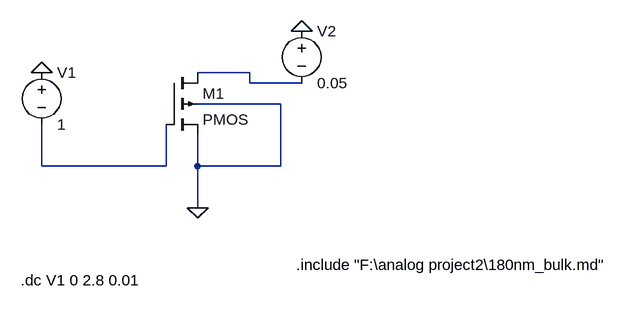
[diagram p0: schematic pmosCharateristics.asc]
pmosCharateristics.asc, the LTspice schematic file:
Version 4
SHEET 1 944 680
WIRE 288 128 208 128
WIRE 288 144 288 128
WIRE 368 144 288 144
WIRE 336 176 208 176
WIRE -32 272 -32 208
WIRE 160 272 160 208
WIRE 160 272 -32 272
WIRE 208 272 208 224
WIRE 336 272 336 176
WIRE 336 272 208 272
WIRE 208 336 208 272
FLAG -32 128 0
FLAG 368 64 0
FLAG 208 336 0
SYMBOL pmos4 160 128 R0
SYMATTR InstName M1
SYMATTR Value2 l=180n w=540n
SYMBOL voltage -32 112 R0
WINDOW 123 0 0 Left 2
WINDOW 39 0 0 Left 2
SYMATTR InstName V1
SYMATTR Value 1
SYMBOL voltage 368 48 R0
WINDOW 123 0 0 Left 2
WINDOW 39 0 0 Left 2
SYMATTR InstName V2
SYMATTR Value 0.05
TEXT 360 424 Left 2 !.include "F:\\analog project2\\180nm_bulk.md"
TEXT -64 448 Left 2 !.dc V1 0 2.8 0.01

The netlist it stands for:
* pmosCharateristics.asc
M1 N001 N002 0 0 PMOS l=180n w=540n
V1 0 N002 1
V2 0 N001 0.05
.model NMOS NMOS
.model PMOS PMOS
.lib standard.mos
.include "F:\analog project2\180nm_bulk.md"
.dc V1 0 2.8 0.01
.backanno
.end